# Altium schematic sheet 4_Light_Screen.SchDoc
size B
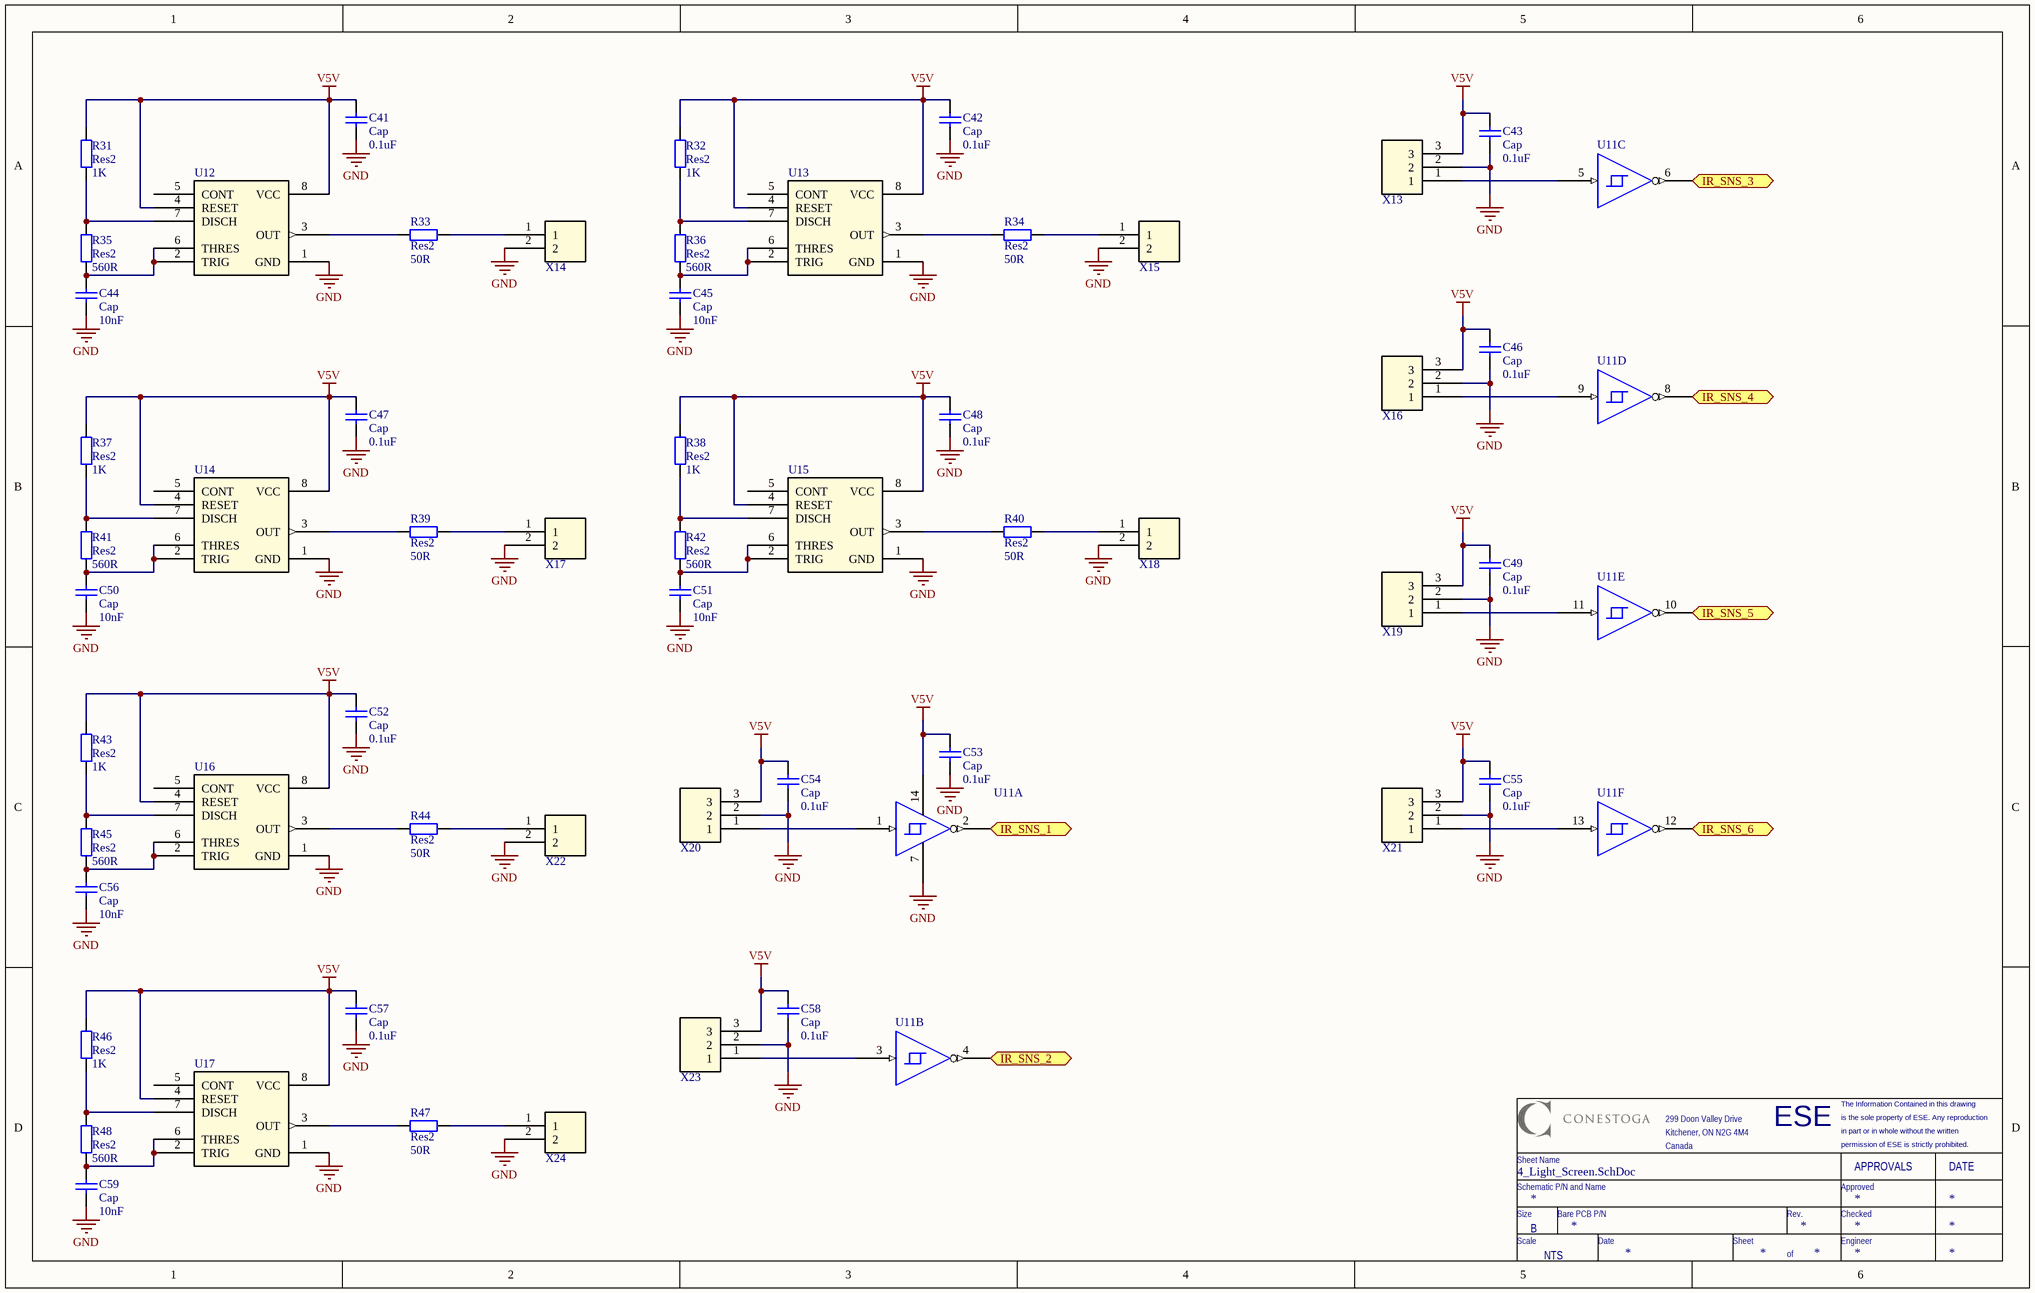
[diagram p0: 4_Light_Screen.SchDoc]

## Parts
C41  Cap  value 0.1uF  [RAD-0.3]
C42  Cap  value 0.1uF  [RAD-0.3]
C43  Cap  value 0.1uF  [RAD-0.3]
C44  Cap  value 10nF  [RAD-0.3]
C45  Cap  value 10nF  [RAD-0.3]
C46  Cap  value 0.1uF  [RAD-0.3]
C47  Cap  value 0.1uF  [RAD-0.3]
C48  Cap  value 0.1uF  [RAD-0.3]
C49  Cap  value 0.1uF  [RAD-0.3]
C50  Cap  value 10nF  [RAD-0.3]
C51  Cap  value 10nF  [RAD-0.3]
C52  Cap  value 0.1uF  [RAD-0.3]
C53  Cap  value 0.1uF  [RAD-0.3]
C54  Cap  value 0.1uF  [RAD-0.3]
C55  Cap  value 0.1uF  [RAD-0.3]
C56  Cap  value 10nF  [RAD-0.3]
C57  Cap  value 0.1uF  [RAD-0.3]
C58  Cap  value 0.1uF  [RAD-0.3]
C59  Cap  value 10nF  [RAD-0.3]
R31  Res2  value 1K  [AXIAL-0.4]
R32  Res2  value 1K  [AXIAL-0.4]
R33  Res2  value 50R  [AXIAL-0.4]
R34  Res2  value 50R  [AXIAL-0.4]
R35  Res2  value 560R  [AXIAL-0.4]
R36  Res2  value 560R  [AXIAL-0.4]
R37  Res2  value 1K  [AXIAL-0.4]
R38  Res2  value 1K  [AXIAL-0.4]
R39  Res2  value 50R  [AXIAL-0.4]
R40  Res2  value 50R  [AXIAL-0.4]
R41  Res2  value 560R  [AXIAL-0.4]
R42  Res2  value 560R  [AXIAL-0.4]
R43  Res2  value 1K  [AXIAL-0.4]
R44  Res2  value 50R  [AXIAL-0.4]
R45  Res2  value 560R  [AXIAL-0.4]
R46  Res2  value 1K  [AXIAL-0.4]
R47  Res2  value 50R  [AXIAL-0.4]
R48  Res2  value 560R  [AXIAL-0.4]
U11  IC HEX SCHMITT-TRIG INV 14-DIP  [14-DIP]  (value not drawn)  (parts A,B,C,D,E,F of 6)
U12  IC OSC SINGLE TIMER 100KHZ 8-DIP  [8-DIP]  (value not drawn)
U13  IC OSC SINGLE TIMER 100KHZ 8-DIP  [8-DIP]  (value not drawn)
U14  IC OSC SINGLE TIMER 100KHZ 8-DIP  [8-DIP]  (value not drawn)
U15  IC OSC SINGLE TIMER 100KHZ 8-DIP  [8-DIP]  (value not drawn)
U16  IC OSC SINGLE TIMER 100KHZ 8-DIP  [8-DIP]  (value not drawn)
U17  IC OSC SINGLE TIMER 100KHZ 8-DIP  [8-DIP]  (value not drawn)
X13  TERM BLOCK HDR 3POS VERT 3.5MM  [WR-TBL-3211 3]  (value not drawn)
X14  TERM BLOCK HDR 2POS VERT 3.5MM  [WR-TBL-3211 2]  (value not drawn)
X15  TERM BLOCK HDR 2POS VERT 3.5MM  [WR-TBL-3211 2]  (value not drawn)
X16  TERM BLOCK HDR 3POS VERT 3.5MM  [WR-TBL-3211 3]  (value not drawn)
X17  TERM BLOCK HDR 2POS VERT 3.5MM  [WR-TBL-3211 2]  (value not drawn)
X18  TERM BLOCK HDR 2POS VERT 3.5MM  [WR-TBL-3211 2]  (value not drawn)
X19  TERM BLOCK HDR 3POS VERT 3.5MM  [WR-TBL-3211 3]  (value not drawn)
X20  TERM BLOCK HDR 3POS VERT 3.5MM  [WR-TBL-3211 3]  (value not drawn)
X21  TERM BLOCK HDR 3POS VERT 3.5MM  [WR-TBL-3211 3]  (value not drawn)
X22  TERM BLOCK HDR 2POS VERT 3.5MM  [WR-TBL-3211 2]  (value not drawn)
X23  TERM BLOCK HDR 3POS VERT 3.5MM  [WR-TBL-3211 3]  (value not drawn)
X24  TERM BLOCK HDR 2POS VERT 3.5MM  [WR-TBL-3211 2]  (value not drawn)

## Ports
IR_SNS_1 (out), IR_SNS_2 (out), IR_SNS_3 (out), IR_SNS_4 (out), IR_SNS_5 (out), IR_SNS_6 (out)

## Nets
GND: C41.1 C42.1 C43.1 C44.1 C45.1 C46.1 C47.1 C48.1 C49.1 C50.1 C51.1 C52.1 C53.1 C54.1 C55.1 C56.1 C57.1 C58.1 C59.1 U11.7(GND_POWER) U12.1(GND) U13.1(GND) U14.1(GND) U15.1(GND) U16.1(GND) U17.1(GND) X13.2 X14.2 X15.2 X16.2 X17.2 X18.2 X19.2 X20.2 X21.2 X22.2 X23.2 X24.2
V5V: C41.2 C42.2 C43.2 C46.2 C47.2 C48.2 C49.2 C52.2 C53.2 C54.2 C55.2 C57.2 C58.2 R31.1 R32.1 R37.1 R38.1 R43.1 R46.1 U11.14(VCC) U12.4(RESET) U12.8(VCC) U13.4(RESET) U13.8(VCC) U14.4(RESET) U14.8(VCC) U15.4(RESET) U15.8(VCC) U16.4(RESET) U16.8(VCC) U17.4(RESET) U17.8(VCC) X13.3 X16.3 X19.3 X20.3 X21.3 X23.3
IR_SNS_1: U11.2(Y) ; port IR_SNS_1
IR_SNS_2: U11.4(Y) ; port IR_SNS_2
IR_SNS_3: U11.6(Y) ; port IR_SNS_3
IR_SNS_4: U11.8(Y) ; port IR_SNS_4
IR_SNS_5: U11.10(Y) ; port IR_SNS_5
IR_SNS_6: U11.12(Y) ; port IR_SNS_6
NetC44_2: C44.2 R35.2 U12.2(TRIG) U12.6(THRES)
NetC45_2: C45.2 R36.2 U13.2(TRIG) U13.6(THRES)
NetC50_2: C50.2 R41.2 U14.2(TRIG) U14.6(THRES)
NetC51_2: C51.2 R42.2 U15.2(TRIG) U15.6(THRES)
NetC56_2: C56.2 R45.2 U16.2(TRIG) U16.6(THRES)
NetC59_2: C59.2 R48.2 U17.2(TRIG) U17.6(THRES)
NetR31_2: R31.2 R35.1 U12.7(DISCH)
NetR32_2: R32.2 R36.1 U13.7(DISCH)
NetR33_1: R33.1 X14.1
NetR33_2: R33.2 U12.3(OUT)
NetR34_1: R34.1 X15.1
NetR34_2: R34.2 U13.3(OUT)
NetR37_2: R37.2 R41.1 U14.7(DISCH)
NetR38_2: R38.2 R42.1 U15.7(DISCH)
NetR39_1: R39.1 X17.1
NetR39_2: R39.2 U14.3(OUT)
NetR40_1: R40.1 X18.1
NetR40_2: R40.2 U15.3(OUT)
NetR43_2: R43.2 R45.1 U16.7(DISCH)
NetR44_1: R44.1 X22.1
NetR44_2: R44.2 U16.3(OUT)
NetR46_2: R46.2 R48.1 U17.7(DISCH)
NetR47_1: R47.1 X24.1
NetR47_2: R47.2 U17.3(OUT)
NetU11_1: U11.1(A) X20.1
NetU11_3: U11.3(A) X23.1
NetU11_5: U11.5(A) X13.1
NetU11_9: U11.9(A) X16.1
NetU11_11: U11.11(A) X19.1
NetU11_13: U11.13(A) X21.1

Not connected (* = marked no-connect by the designer): U12 5(CONT); U13 5(CONT); U14 5(CONT); U15 5(CONT); U16 5(CONT); U17 5(CONT)

## Notes on the sheet
- ESE
- is the sole property of ESE. Any reproduction
- The Information Contained in this drawing
- Schematic P/N and Name
- Sheet Name
- 299 Doon Valley Drive
- Kitchener, ON N2G 4M4
- Canada
- Approved
- in part or in whole without the written
- permission of ESE is strictly prohibited.
- APPROVALS
- DATE
- Size
- Scale
- B
- NTS
- Bare PCB P/N
- Date
- Sheet
- Rev.
- Checked
- Engineer
- of

## Library data of the parts
C41-C59 = Cap: Capacitor; Published: 8-Jun-2000; LatestRevisionDate: 17-Jul-2002; LatestRevisionNote: Re-released for DXP Platform.; PackageReference: RAD-0.3; Publisher: Altium Limited; PackageDescription: Radial Cap, Thru-Hole; 2 Leads; 0.3 in Pin Spacing
R31-R48 = Res2: Resistor; Published: 8-Jun-2000; LatestRevisionDate: 17-Jul-2002; LatestRevisionNote: Re-released for DXP Platform.; PackageReference: AXIAL-0.4; Publisher: Altium Limited; PackageDescription: Axial Device, Thru-Hole; 2 Leads; 0.4 in Pin Spacing
U11 = IC HEX SCHMITT-TRIG INV 14-DIP: Manufactuer_Part_Number: SN74ACT14N; Manufacturer: Texas Instruments; Digi-Key_Part_Number: 296-4368-5-ND
U12-U17 = IC OSC SINGLE TIMER 100KHZ 8-DIP: Manufacturer_Part_Number: NE555P; Manufacturer: Texas Instruments; Digi-Key_Part_Number: 296-1411-5-ND
X13 X16 X19-X21 X23 = TERM BLOCK HDR 3POS VERT 3.5MM: Manufacturer_Part_Number: 691321100003; Manufacturer: Wurth Electronics Inc; DigiKey_Part_Number: 732-2764-ND
X14 X15 X17 X18 X22 X24 = TERM BLOCK HDR 2POS VERT 3.5MM: Manufacturer_Part_Number: 691321100002; Manufacturer: Wurth Electronics Inc; DigiKey_Part_Number: 732-2763-ND